# Altium schematic sheet Page 3.SchDoc
size 840 x 594 mm; Address1: Address1; Address2: Address2; Address3: Address3; Address4: Address4; DocumentNumber: НЭС.185014.2017-5.1; SheetNumber: 3; SheetTotal: 3; Scale: 1:1; DocumentType: Схема электрическая принципиальная; FirstReferrence: НЭС.185014.2017-5.1
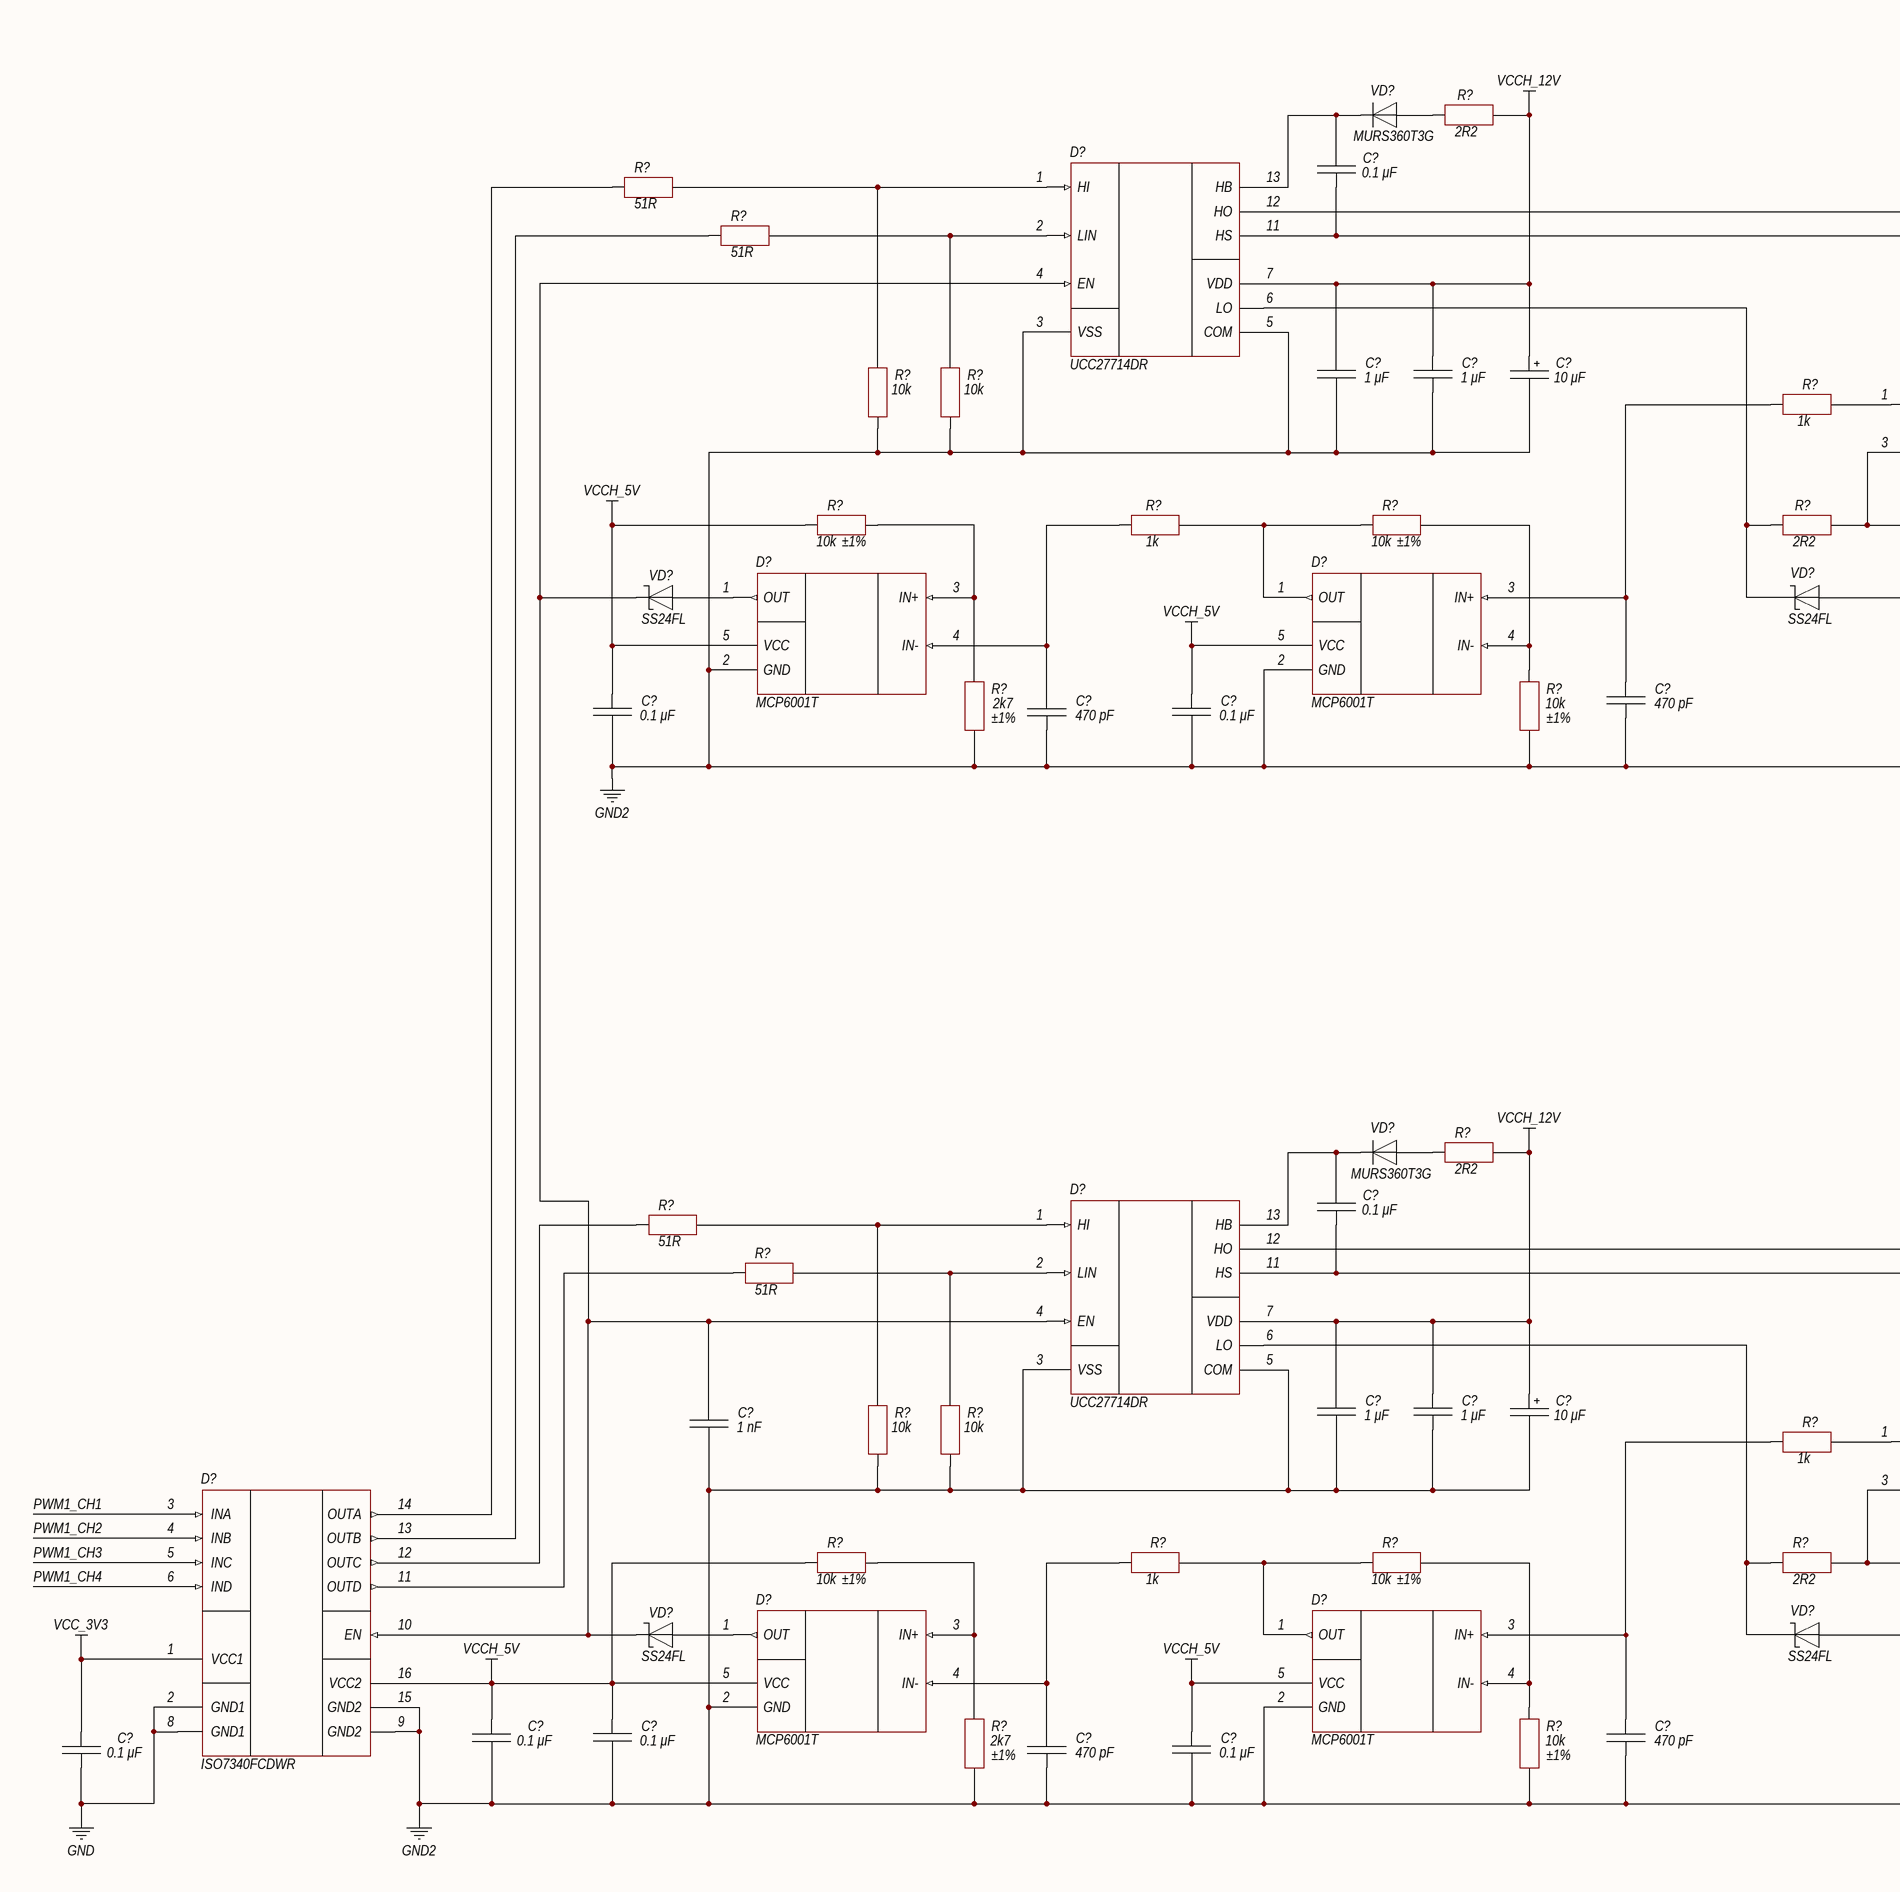
[diagram p0: Page 3.SchDoc, left]
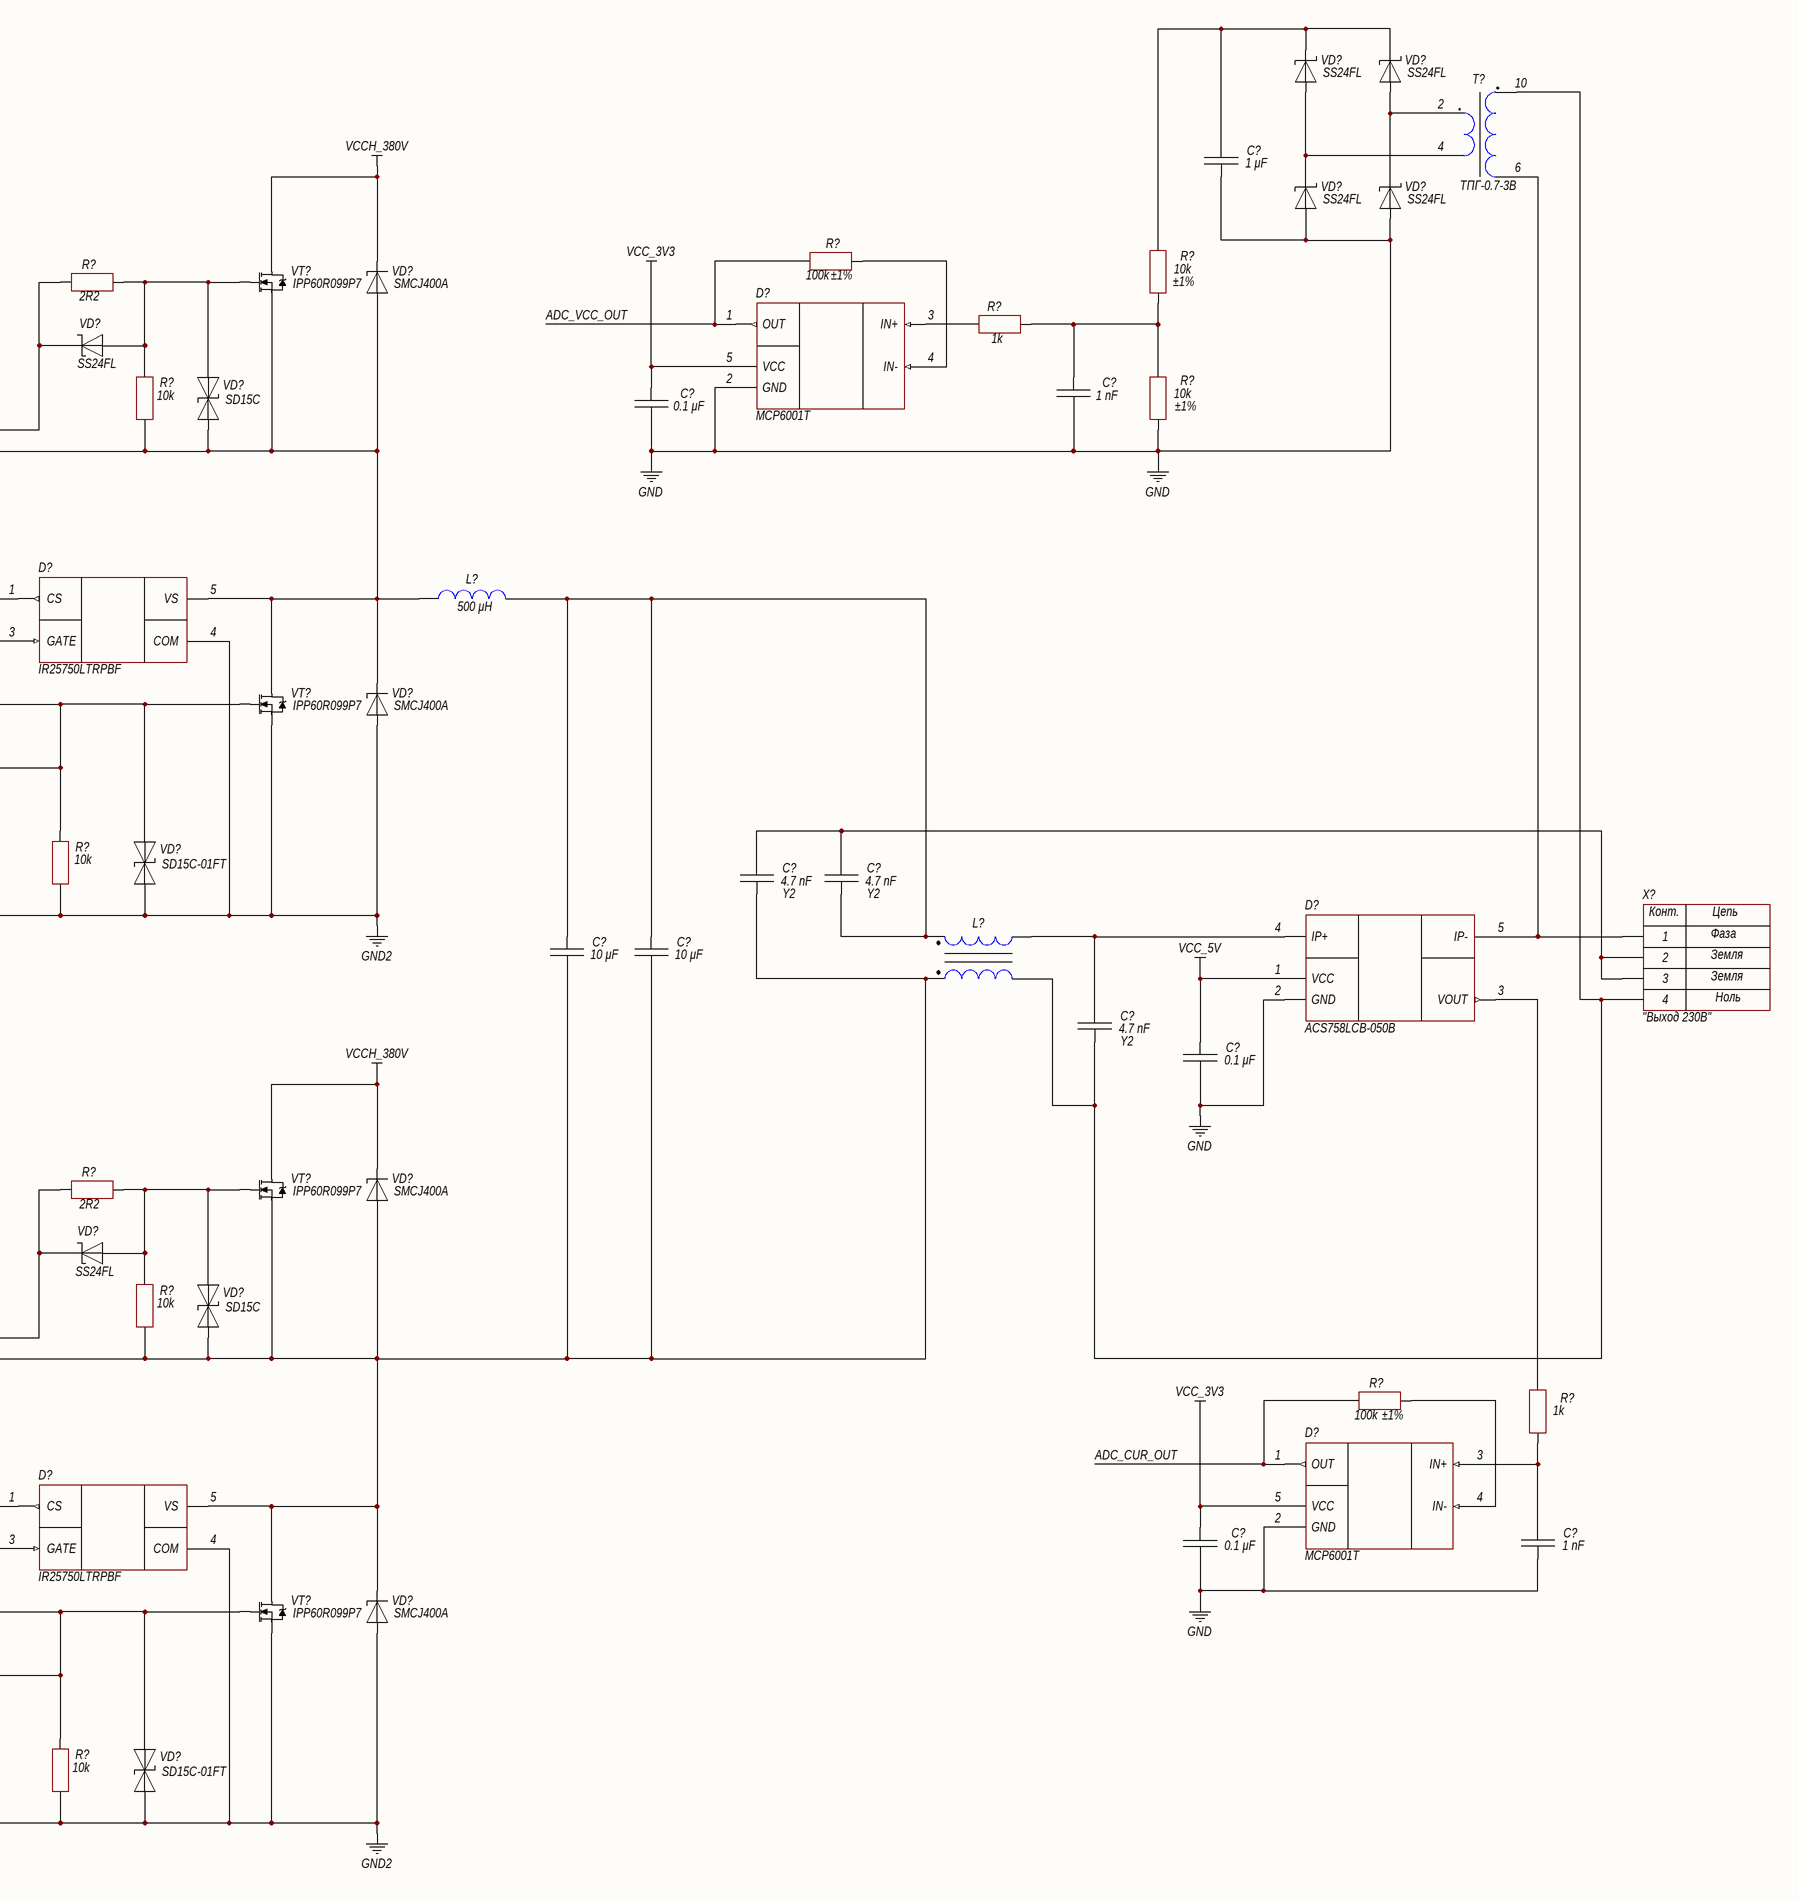
[diagram p1: Page 3.SchDoc, right]

## Parts
(Parts that share a designator on the sheet are numbered #1, #2 ... from top to bottom, then left to right.)
C?#1  1 μF  [CH0805C]
C?#2  0.1 μF  [CH1206C]
C?#3  1 nF  [CH0805C]
C?#4  0.1 μF  [CH0805C]
C?#5  10 μF  [TANTAL_C]
C?#6  1 μF  [CH0805C]
C?#7  1 μF  [CH0805C]
C?#8  470 pF  [CH0805C]
C?#9  470 pF  [CH0805C]
C?#10  0.1 μF  [CH0805C]
C?#11  0.1 μF  [CH0805C]
C?#12  4.7 nF  ComponentKind: Y2  [CAP: B32021]
C?#13  4.7 nF  ComponentKind: Y2  [CAP: B32021]
C?#14  10 μF  [CAP: B32676]
C?#15  10 μF  [CAP: B32676]
C?#16  4.7 nF  ComponentKind: Y2  [CAP: B32021]
C?#17  0.1 μF  [CH0805C]
C?#18  0.1 μF  [CH1206C]
C?#19  10 μF  [TANTAL_C]
C?#20  1 μF  [CH0805C]
C?#21  1 μF  [CH0805C]
C?#22  1 nF  [CH0805C]
C?#23  0.1 μF  [CH0805C]
C?#24  1 nF  [CH0805C]
C?#25  470 pF  [CH0805C]
C?#26  470 pF  [CH0805C]
C?#27  0.1 μF  [CH0805C]
C?#28  0.1 μF  [CH0805C]
C?#29  0.1 μF  [CH0805C]
C?#30  0.1 μF  [CH0805C]
D?#1  MCP6001T  [SOT23-5]
D?#2  UCC27714DR  [14-SOIC]
D?#3  IR25750LTRPBF  [SOT23-5]
D?#4  MCP6001T  [SOT23-5]
D?#5  MCP6001T  [SOT23-5]
D?#6  ACS758LCB-050B  [IC: ACS770]
D?#7  UCC27714DR  [14-SOIC]
D?#8  MCP6001T  [SOT23-5]
D?#9  IR25750LTRPBF  [SOT23-5]
D?#10  ISO7340FCDWR  [16-SOIC (W)]
D?#11  MCP6001T  [SOT23-5]
D?#12  MCP6001T  [SOT23-5]
L?#1  500 μH  [IND: R46]
L?#2  0077071A7  [IND: R32]  (value not drawn)
R?#1  10k  ComponentKind: ±1%  [CH0805R]
R?#2  100k  ComponentKind: ±1%  [CH0805R]
R?#3  2R2  [CH0805R]
R?#4  1k  [CH0805R]
R?#5  2R2  [CH0805R]
R?#6  10k  ComponentKind: ±1%  [CH0805R]
R?#7  51R  [CH0805R]
R?#8  10k  [CH0805R]
R?#9  51R  [CH0805R]
R?#10  1k  [CH0805R]
R?#11  10k  [CH0805R]
R?#12  10k  [CH0805R]
R?#13  10k  ComponentKind: ±1%  [CH0805R]
R?#14  1k  [CH0805R]
R?#15  10k  ComponentKind: ±1%  [CH0805R]
R?#16  2R2  [CH0805R]
R?#17  2k7  ComponentKind: ±1%  [CH0805R]
R?#18  10k  ComponentKind: ±1%  [CH0805R]
R?#19  10k  [CH0805R]
R?#20  2R2  [CH0805R]
R?#21  2R2  [CH0805R]
R?#22  51R  [CH0805R]
R?#23  10k  [CH0805R]
R?#24  51R  [CH0805R]
R?#25  1k  [CH0805R]
R?#26  100k  ComponentKind: ±1%  [CH0805R]
R?#27  1k  [CH0805R]
R?#28  10k  [CH0805R]
R?#29  10k  [CH0805R]
R?#30  10k  ComponentKind: ±1%  [CH0805R]
R?#31  1k  [CH0805R]
R?#32  10k  ComponentKind: ±1%  [CH0805R]
R?#33  2R2  [CH0805R]
R?#34  2k7  ComponentKind: ±1%  [CH0805R]
R?#35  10k  ComponentKind: ±1%  [CH0805R]
R?#36  10k  [CH0805R]
T?  ТПГ-0.7-3В  [TRANS: ТПК-7]
VD?#1  SS24FL  [SOD123F]
VD?#2  SS24FL  [SOD123F]
VD?#3  SS24FL  [SOD123F]
VD?#4  SS24FL  [SOD123F]
VD?#5  SMCJ400A  [SMC]
VD?#6  MURS360T3G  [SMC]
VD?#7  SS24FL  [SOD123F]
VD?#8  SD15C  [SOD323]
VD?#9  SMCJ400A  [SMC]
VD?#10  SS24FL  [SOD123F]
VD?#11  SS24FL  [SOD123F]
VD?#12  SD15C-01FT  [SOD323]
VD?#13  SMCJ400A  [SMC]
VD?#14  MURS360T3G  [SMC]
VD?#15  SS24FL  [SOD123F]
VD?#16  SD15C  [SOD323]
VD?#17  SMCJ400A  [SMC]
VD?#18  SS24FL  [SOD123F]
VD?#19  SS24FL  [SOD123F]
VD?#20  SD15C-01FT  [SOD323]
VT?#1  IPP60R099P7  [TO220_123]
VT?#2  IPP60R099P7  [TO220_123]
VT?#3  IPP60R099P7  [TO220_123]
VT?#4  IPP60R099P7  [TO220_123]
X?  "Выход 230В"  [CON: X977B04]

## Nets
GND: C?#1.1 C?#3.1 C?#4.1 C?#17.1 C?#23.1 C?#24.1 C?#29.1 D?#1.2(GND) D?#6.2(GND) D?#8.2(GND) D?#10.2(GND1) D?#10.8(GND1) R?#6.2 VD?#3.1 VD?#4.1
GND2: C?#5.2 C?#6.1 C?#7.1 C?#8.2 C?#9.2 C?#10.1 C?#11.1 C?#19.2 C?#20.1 C?#21.1 C?#22.1 C?#25.2 C?#26.2 C?#27.1 C?#28.1 C?#30.1 D?#2.3(VSS) D?#2.5(COM) D?#3.4(COM) D?#4.2(GND) D?#5.2(GND) D?#7.3(VSS) D?#7.5(COM) D?#9.4(COM) D?#10.9(GND2) D?#10.15(GND2) D?#11.2(GND) D?#12.2(GND) R?#11.1 R?#12.1 R?#17.2 R?#18.2 R?#19.1 R?#28.1 R?#29.1 R?#34.2 R?#35.2 R?#36.1 VD?#9.1(A) VD?#12.1(A) VD?#17.1(A) VD?#20.1(A) VT?#2.3(S) VT?#4.3(S)
VCC_3V3: C?#4.2 C?#23.2 C?#29.2 D?#1.5(VCC) D?#8.5(VCC) D?#10.1(VCC1)
VCC_5V: C?#17.2 D?#6.1(VCC)
VCCH_5V: C?#10.2 C?#11.2 C?#27.2 C?#28.2 C?#30.2 D?#4.5(VCC) D?#5.5(VCC) D?#10.16(VCC2) D?#11.5(VCC) D?#12.5(VCC) R?#13.2 R?#30.2
VCCH_12V: C?#5.1 C?#6.2 C?#7.2 C?#19.1 C?#20.2 C?#21.2 D?#2.7(VDD) D?#7.7(VDD) R?#5.1 R?#21.1
VCCH_380V: VD?#5.2(C) VD?#13.2(C) VT?#1.2(D) VT?#3.2(D)
ADC_CUR_OUT: D?#8.1(OUT) R?#26.1
ADC_VCC_OUT: D?#1.1(OUT) R?#2.2
PWM1_CH1: D?#10.3(INA)
PWM1_CH2: D?#10.4(INB)
PWM1_CH3: D?#10.5(INC)
PWM1_CH4: D?#10.6(IND)
NetC?#1_2: C?#1.2 R?#1.1 VD?#1.2 VD?#2.2
NetC?#2_1: C?#2.1 D?#2.13(HB) VD?#6.2
NetC?#2_2: C?#2.2 D?#2.11(HS) D?#3.5(VS) L?#1.2 R?#8.1 VD?#5.1(A) VD?#8.1(A) VD?#9.2(C) VT?#1.3(S) VT?#2.2(D)
NetC?#3_2: C?#3.2 R?#1.2 R?#4.2 R?#6.1
NetC?#8_1: C?#8.1 D?#5.3(IN+) R?#10.1
NetC?#9_1: C?#9.1 D?#4.4(IN-) R?#14.2
NetC?#12_1: C?#12.1 C?#14.1 C?#15.1 C?#18.2 D?#7.11(HS) D?#9.5(VS) L?#2.3 R?#23.1 VD?#13.1(A) VD?#16.1(A) VD?#17.2(C) VT?#3.3(S) VT?#4.2(D)
NetC?#12_2: C?#12.2 C?#13.2 X?.2 X?.3
NetC?#13_1: C?#13.1 C?#14.2 C?#15.2 L?#1.1 L?#2.1
NetC?#16_1: C?#16.1 L?#2.4 T?.10 X?.4
NetC?#16_2: C?#16.2 D?#6.4(IP+) L?#2.2
NetC?#18_1: C?#18.1 D?#7.13(HB) VD?#14.2
NetC?#22_2: C?#22.2 D?#2.4(EN) D?#7.4(EN) D?#10.10(EN) VD?#10.2 VD?#18.2
NetC?#24_2: C?#24.2 D?#8.3(IN+) R?#25.2
NetC?#25_1: C?#25.1 D?#12.3(IN+) R?#27.1
NetC?#26_1: C?#26.1 D?#11.4(IN-) R?#31.2
NetD?#1_3: D?#1.3(IN+) R?#4.1
NetD?#1_4: D?#1.4(IN-) R?#2.1
NetD?#2_1: D?#2.1(HI) R?#7.1 R?#11.2
NetD?#2_2: D?#2.2(LIN) R?#9.1 R?#12.2
NetD?#2_6: D?#2.6(LO) R?#16.2 VD?#11.2
NetD?#2_12: D?#2.12(HO) R?#3.2 VD?#7.2
NetD?#3_1: D?#3.1(CS) R?#10.2
NetD?#3_3: D?#3.3(GATE) R?#16.1 R?#19.2 VD?#11.1 VD?#12.2(C) VT?#2.1(G)
NetD?#4_1: D?#4.1(OUT) VD?#10.1
NetD?#4_3: D?#4.3(IN+) R?#13.1 R?#17.1
NetD?#5_1: D?#5.1(OUT) R?#14.1 R?#15.1
NetD?#5_4: D?#5.4(IN-) R?#15.2 R?#18.1
NetD?#6_3: D?#6.3(VOUT) R?#25.1
NetD?#6_5: D?#6.5(IP-) T?.6 X?.1
NetD?#7_1: D?#7.1(HI) R?#22.1 R?#28.2
NetD?#7_2: D?#7.2(LIN) R?#24.1 R?#29.2
NetD?#7_6: D?#7.6(LO) R?#33.2 VD?#19.2
NetD?#7_12: D?#7.12(HO) R?#20.2 VD?#15.2
NetD?#8_4: D?#8.4(IN-) R?#26.2
NetD?#9_1: D?#9.1(CS) R?#27.2
NetD?#9_3: D?#9.3(GATE) R?#33.1 R?#36.2 VD?#19.1 VD?#20.2(C) VT?#4.1(G)
NetD?#10_11: D?#10.11(OUTD) R?#24.2
NetD?#10_12: D?#10.12(OUTC) R?#22.2
NetD?#10_13: D?#10.13(OUTB) R?#9.2
NetD?#10_14: D?#10.14(OUTA) R?#7.2
NetD?#11_1: D?#11.1(OUT) VD?#18.1
NetD?#11_3: D?#11.3(IN+) R?#30.1 R?#34.1
NetD?#12_1: D?#12.1(OUT) R?#31.1 R?#32.1
NetD?#12_4: D?#12.4(IN-) R?#32.2 R?#35.1
NetR?#3_1: R?#3.1 R?#8.2 VD?#7.1 VD?#8.2(C) VT?#1.1(G)
NetR?#5_2: R?#5.2 VD?#6.1
NetR?#20_1: R?#20.1 R?#23.2 VD?#15.1 VD?#16.2(C) VT?#3.1(G)
NetR?#21_2: R?#21.2 VD?#14.1
NetT?_2: T?.2 VD?#2.1 VD?#4.2
NetT?_4: T?.4 VD?#1.1 VD?#3.2

## Notes on the sheet
- Фаза
- Земля
- Ноль
- Перв. примен.
- Справ. №
- Подп. и дата
- Инв. № дубл.
- Взам. инв. №
- Инв. № подл.
- Изм.
- Лист
- № докум.
- Подп.
- Дата
- 2.106-A2
- Копировал
- Формат А1
- (in symbol 4-Connector) Конт.; Цепь

## Library data of the parts
C?#1 C?#6 C?#7 C?#20 C?#21 = Capacitor: Manufacturer: Yageo; Model: CC0805KKX7R8BB105; HelpURL: https://www.digikey.com/product-detail/en/yageo/CC0805KKX7R8BB105/311-1456-1-ND/2833762; ComponentKind: X7R; Value: 1 μF
C?#2 C?#18 = Capacitor: Manufacturer: Yageo; Model: CC1206KRX7R9BB104; HelpURL: https://www.digikey.com/product-detail/en/yageo/CC1206KRX7R9BB104/311-1179-1-ND/303089; ComponentKind: X7R; Value: 0.1 μF
C?#3 C?#22 C?#24 = Capacitor: Manufacturer: Yageo; Model: CC0805KRX7R9BB102; HelpURL: https://www.digikey.com/product-detail/en/yageo/CC0805KRX7R9BB102/311-1127-1-ND/303037; ComponentKind: X7R; Value: 1 nF
C?#4 C?#10 C?#11 C?#17 C?#23 C?#27-C?#30 = Capacitor: Manufacturer: Yageo; Model: CC0805KRX7R8BB104; HelpURL: https://www.digikey.com/product-detail/en/yageo/CC0805KRX7R8BB104/311-1141-1-ND/303051; ComponentKind: X7R; Value: 0.1 μF
C?#5 C?#19 = TantalCap: Manufacturer: Vishay Sprague; Model: TR3C106K025C0300; HelpURL: https://www.digikey.com/product-detail/en/vishay-sprague/TR3C106K025C0300/718-1508-1-ND/1859983; ComponentKind: 25V; Value: 10 μF
C?#8 C?#9 C?#25 C?#26 = Capacitor: Manufacturer: Yageo; Model: CC0805KRX7R9BB471; HelpURL: https://www.digikey.com/product-detail/en/yageo/CC0805KRX7R9BB471/311-1124-1-ND/303034; ComponentKind: X7R; Value: 470 pF
C?#12 C?#13 C?#16 = Capacitor: Manufacturer: EPCOS (TDK); Model: B32021A3472M; HelpURL: https://www.digikey.com/product-detail/en/epcos-tdk/B32021A3472M000/495-4082-ND/2045205; Value: 4.7 nF
C?#14 C?#15 = Capacitor: Manufacturer: Epcos; Model: B32676E4106K000; HelpURL: https://www.digikey.com/products/en?keywords=B32676E4106K000; ComponentKind: 275V AC; Value: 10 μF
D?#1 D?#4 D?#5 D?#8 D?#11 D?#12 = MCP6001T: OP amplifier; Manufacturer: Microchip Technology; Model: MCP6001T-I/OT; HelpURL: https://www.digikey.com/product-detail/en/microchip-technology/MCP6001T-I-OT/MCP6001T-I-OTCT-ND/697158; ComponentKind: SOT23-5
D?#2 D?#7 = UCC27714DR: Half-bridge driver; Manufacturer: Texas Instruments; Model: UCC27714DR; HelpURL: https://www.digikey.com/product-detail/en/texas-instruments/UCC27714DR/296-42701-1-ND/5455966; ComponentKind: 14-SOIC
D?#3 D?#9 = IR25750LTRPBF: Sensor; Manufacturer: Infineon Technologies; Model: IR25750LTRPBF; ComponentKind: SOT23-5; HelpURL: https://www.digikey.com/product-detail/en/infineon-technologies/IR25750LTRPBF/IR25750LTRPBFCT-ND/4743688
D?#6 = ACS770LCB: Sensor; Manufacturer: Allegro MicroSystems, LLC; Model: ACS758LCB-050B-PFF-T; HelpURL: https://www.digikey.com/product-detail/en/allegro-microsystems-llc/ACS758LCB-050B-PFF-T/620-1320-ND/2042745; ComponentKind: 40mV/A
D?#10 = ISO7340FCDWR: Isolator; Manufacturer: Texas Instruments; Model: ISO7340FCDWR; ComponentKind: 16-SOIC; HelpURL: https://www.digikey.com/product-detail/en/texas-instruments/ISO7340FCDWR/296-47262-1-ND/7688272
L?#1 = Inductor ring: Manufacturer: Magnetics; Model: 0077439A7; Value: 500 μH; ComponentKind: 60 μ; HelpURL: http://ferrite.ru/warehouse/r-46-724-118-77439-a7.html
L?#2 = EMI filter: Manufacturer: Magnetics; Model: 0077071A7; HelpURL: http://ferrite.ru/warehouse/r-32-820-110-7-77071-a7.html; ComponentKind: R32/20/10
R?#1 R?#6 R?#13 R?#15 R?#18 R?#30 R?#32 R?#35 = Resistor: Manufacturer: Yageo; Model: RC0805FR-0710KL; HelpURL: https://www.digikey.com/product-detail/en/yageo/RC0805FR-0710KL/311-10.0KCRCT-ND/730482; Value: 10k
R?#2 R?#26 = Resistor: Manufacturer: Yageo; Model: RC0805FR-07100KL; HelpURL: https://www.digikey.com/product-detail/en/yageo/RC0805FR-07100KL/311-100KCRCT-ND/730491; Value: 100k
R?#3 R?#5 R?#16 R?#20 R?#21 R?#33 = Resistor: Manufacturer: Yageo; Model: RC0805JR-072R2L; HelpURL: https://www.digikey.com/product-detail/en/yageo/RC0805JR-072R2L/311-2.2ARCT-ND/731217; ComponentKind: 0805; Value: 2R2
R?#4 R?#10 R?#14 R?#25 R?#27 R?#31 = Resistor: Manufacturer: Yageo; Model: RC0805JR-071KL; HelpURL: https://www.digikey.com/product-detail/en/yageo/RC0805JR-071KL/311-1.0KARCT-ND/731165; ComponentKind: 0805; Value: 1k
R?#7 R?#9 R?#22 R?#24 = Resistor: Manufacturer: Yageo; Model: RC0805JR-0751RL; HelpURL: https://www.digikey.com/product-detail/en/yageo/RC0805JR-0751RL/311-51ARCT-ND/731292; ComponentKind: 0805; Value: 51R
R?#8 R?#11 R?#12 R?#19 R?#23 R?#28 R?#29 R?#36 = Resistor: Manufacturer: Yageo; Model: RC0805JR-0710KL; HelpURL: https://www.digikey.com/product-detail/en/yageo/RC0805JR-0710KL/311-10KARCT-ND/731188; ComponentKind: 0805; Value: 10k
R?#17 R?#34 = Resistor: Manufacturer: Yageo; Model: RC0805FR-072K7L; HelpURL: https://www.digikey.com/product-detail/en/yageo/RC0805FR-072K7L/311-2.70KCRCT-ND/730653; Value: 2k7
T? = Sensor: Manufacturer: НПК «Комплекс»; Model: ТПГ-0.7-3В; HelpURL: https://www.chipdip.ru/product/tpk-0.7-3v; ComponentKind: Voltage sensor
VD?#1-VD?#4 VD?#7 VD?#10 VD?#11 VD?#15 VD?#18 VD?#19 = Diod Schottky: Manufacturer: Fairchild/ON Semiconductor; ComponentKind: SOD-123F; Model: SS24FL; HelpURL: https://www.digikey.com/product-detail/en/fairchild-on-semiconductor/SS24FL/SS24FLCT-ND/5305093
VD?#5 VD?#9 VD?#13 VD?#17 = Diod Zener: Manufacturer: Littelfuse Inc.; ComponentKind: SMC; Model: SMCJ400A; HelpURL: https://www.digikey.com/product-detail/en/littelfuse-inc/SMCJ400A/SMCJ400ALFCT-ND/762670
VD?#6 VD?#14 = Diod: Manufacturer: ON Semiconductor; ComponentKind: SMC; Model: MURS360T3G; HelpURL: https://www.digikey.com/product-detail/en/on-semiconductor/MURS360T3G/MURS360T3GOSCT-ND/964580
VD?#8 VD?#12 VD?#16 VD?#20 = TVS-diod: Manufacturer: Littelfuse Inc.; Model: SD15C-01FTG; ComponentKind: SOD-323; HelpURL: https://www.digikey.com/product-detail/en/littelfuse-inc/SD15C-01FTG/F6444CT-ND/5019598
VT?#1-VT?#4 = N-chanel: Mosfet; Manufacturer: Infineon Technologies; Model: IPP60R099P7XKSA1; ComponentKind: TO-220; HelpURL: https://www.digikey.com/products/en?keywords=IPP60R099P7XKSA1
X? = 4-Connector: Manufacturer: Ningbo Xinya M&E; Model: X977B04; HelpURL: https://www.chipdip.ru/product/x977b04; ComponentKind: 10A